# EAGLE design masterclock (EAGLE 8.1.0)
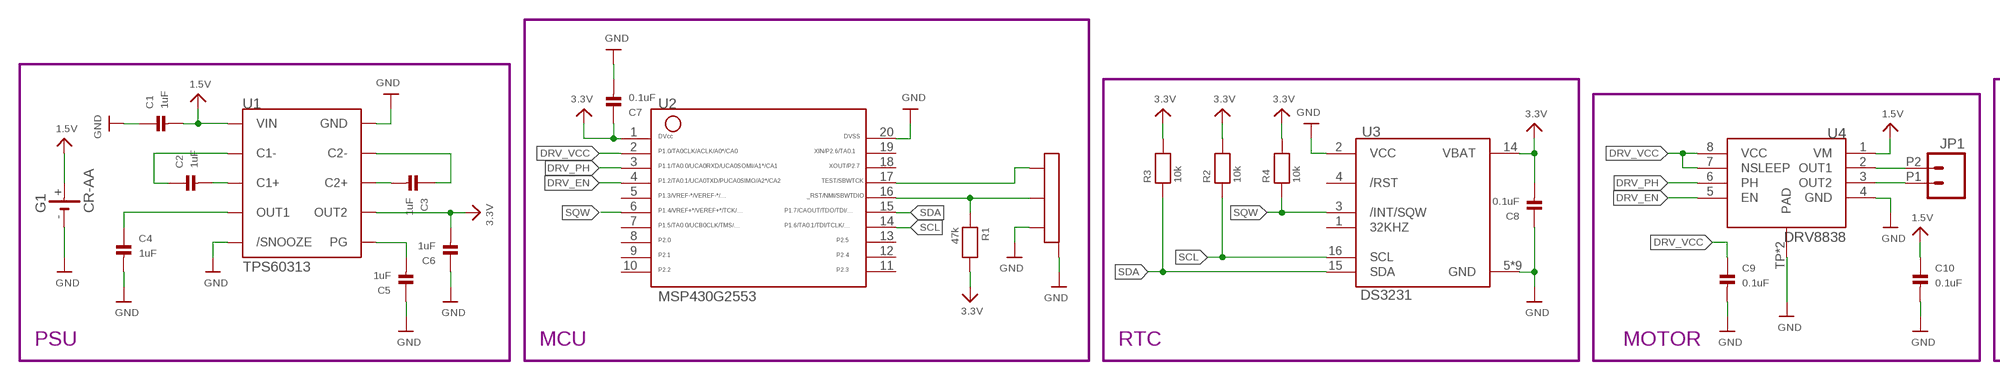
[diagram p0: schematic, sheet 1, part 1 of 2]
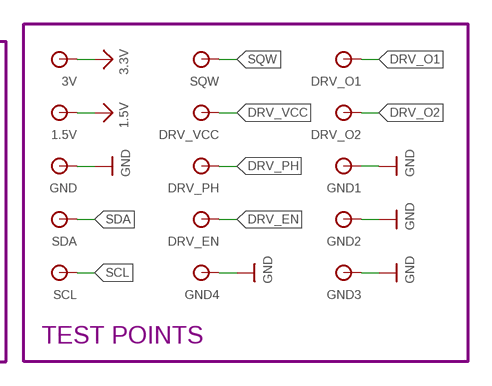
[diagram p1: schematic, sheet 1, part 2 of 2]

## Parts
1.5V  TESTPAD  [TESTPAD]
3V  TESTPAD  [TESTPAD]
C1  1uF  CAP_CERAMIC0402  [0402]
C2  1uF  CAP_CERAMIC0402  [0402]
C3  1uF  CAP_CERAMIC0402  [0402]
C4  1uF  CAP_CERAMIC0402  [0402]
C5  1uF  CAP_CERAMIC0402  [0402]
C6  1uF  CAP_CERAMIC0402  [0402]
C7  0.1uF  CAP_CERAMIC0402  [0402]
C8  0.1uF  CAP_CERAMIC0402  [0402]
C9  0.1uF  CAP_CERAMIC0402  [0402]
C10  0.1uF  CAP_CERAMIC0402  [0402]
DRV_EN  TESTPAD  [TESTPAD]
DRV_O1  TESTPAD  [TESTPAD]
DRV_O2  TESTPAD  [TESTPAD]
DRV_PH  TESTPAD  [TESTPAD]
DRV_VCC  TESTPAD  [TESTPAD]
G1  CR-AA  [CRAA]
GND  TESTPAD  [TESTPAD]
GND1  GND  TESTPAD  [TESTPAD]
GND2  GND  TESTPAD  [TESTPAD]
GND3  GND  TESTPAD  [TESTPAD]
GND4  GND  TESTPAD  [TESTPAD]
JP1  M022.54MM_SCREWTERM  [1X02_2.54_SCREWTERM]
R1  47k  RESISTOR0402  [0402]
R2  10k  RESISTOR0402  [0402]
R3  10k  RESISTOR0402  [0402]
R4  10k  RESISTOR0402  [0402]
SCL  TESTPAD  [TESTPAD]
SDA  TESTPAD  [TESTPAD]
SQW  TESTPAD  [TESTPAD]
U1  TPS60313  [MSOP10]
U2  MSP430G2553  [PW20]
U3  DS3231  [SO16]
U4  DRV8838  [WSON8]
U$27  M03  [TE-MICRO-MNL-]

## Nets
1.5V: 1.5V.P$1 C1.2 C10.1 G1.+ U1.P$3(VIN) U4.1(VM)
3.3V: 3V.P$1 C6.2 C7.1 C8.2 R1.2 R2.2 R3.2 R4.2 U1.P$6(OUT2) U2.1 U3.14(VBAT)
/RST: R1.1 U2.16 U$27.P$2
DRV_EN: DRV_EN.P$1 U2.4 U4.5(EN)
DRV_O1: DRV_O1.P$1 JP1.P2 U4.2(OUT1)
DRV_O2: DRV_O2.P$1 JP1.P1 U4.3(OUT2)
DRV_PH: DRV_PH.P$1 U2.3 U4.6(PH)
DRV_VCC: C9.1 DRV_VCC.P$1 U2.2 U4.7(NSLEEP) U4.8(VCC)
GND: C1.1 C4.2 C5.1 C6.1 C7.2 C8.1 C9.2 C10.2 G1.- GND1.P$1 GND2.P$1 GND3.P$1 GND4.P$1 GND.P$1 U1.P$1(/SNOOZE) U1.P$9(GND) U2.20 U3.2(VCC) U3.5(GND) U3.6(GND) U3.7(GND) U3.8(GND) U3.9(GND) U3.10(GND) U3.11(GND) U3.12(GND) U3.13(GND) U4.4(GND) U4.TP1(PAD) U4.TP(PAD) U$27.H1 U$27.H2 U$27.P$3
N$2: C2.2 U1.P$4(C1+)
N$3: C2.1 U1.P$2(C1-)
N$6: C3.1 U1.P$8(C2-)
N$7: C3.2 U1.P$7(C2+)
N$11: C5.2 U1.P$10(PG)
PWROUT: C4.1 U1.P$5(OUT1)
SCL: R2.1 SCL.P$1 U2.14 U3.16(SCL)
SDA: R3.1 SDA.P$1 U2.15 U3.15(SDA)
SQW: R4.1 SQW.P$1 U2.6 U3.3(/INT/SQW)
TEST: U2.17 U$27.P$1
Unconnected: U2.5 U2.7 U2.8 U2.9 U2.10 U2.11 U2.12 U2.13 U2.18 U2.19 U3.1(32KHZ) U3.4(/RST)

## Notes on the sheet
- PSU | MCU | RTC | MOTOR | TEST POINTS

## Library data of the parts
1.5V 3V DRV_EN DRV_O1 DRV_O2 DRV_PH DRV_VCC GND GND1-GND4 SCL SDA SQW = lepaute:TESTPAD
C1-C10 = lepaute:CAP_CERAMIC: Ceramic Capacitors 0402 - 0402 Surface Mount Capacitors 16pF 50V 5% [Digikey: 445-4899-2-ND] 18pF 50V 5% [Digikey: 490-1281-2-ND] 22pF 50V 5% [Digikey: 490-1283-2-ND] 68pF 50V 5% [Digikey: 490-1289-2-ND] 0.1uF 10V 10% [Digikey: 490-1318-2-ND] 1.0uF 6.3V 10% [Digikey: 490-1320-2-ND] 0603 - 0603 Surface Mount Capacitors 16 pF 50V 5% [Digikey: 445-5051-2-ND] 22 pF 50V [Digikey: PCC220ACVTR-ND] 33 pF 50V 5% [Digikey: 490-1415-1-ND] 56pF 50V 5% [Digikey: 490-1421-1-ND] 220pF 50V 5% [Digikey: 445-1285-1-ND] 680 pF 50V 2200 pF 50V 5% C0G [Digikey: 445-1297-1-ND] 5600 pF 100V 5% X7R [Digikey: 478-3711-1-ND] 0.1 µF 25V 10% [Digikey: PCC2277TR-ND] 0.22 µF 16V 10% X7R [Digikey: 445-1318-1-ND] 1.0 µF 25V 10% [Digikey: 445-5146-2-ND] 0603 - RF Specific 3pF 250V +/-0.1pF RF [Digikey: 712-1347-1-ND] 18 pF 250V 5% [Digikey: 478-3505-1-ND or 712-1322-1-ND] 56 pF 250V 5% C0G RF [Digikey: 490-4867-1-ND] 68 pF 250V RF [Digikey: 490-4868-1-ND] 0805 - 0805 Surface Mount Capacitors 220 pF 250V 2% RF Ceramic Capacitor [Digikey: 712-1398-1-ND] 1000 pF 50V 2% NP0 Ceramic Capacitor [Digikey: 478-3760-1-ND] 0.1 µF 25V 10% Ceramic Capacitor [Digikey: PCC1828TR-ND] 1.0 µF 16V 10% Ceramic Capacitor[Digikey: 490-1691-2-ND] 10.0 µF 10V 10% Ceramic Capacitor[Digikey: 709-1228-1-ND] 10.0 uF 16V 10% Ceramic Capacitor [Digikey: 478-5165-2-ND] 47 uF 6.3V 20% Ceramic Capacitor [Digikey: 587-1779-1-ND or 399-5506-1-ND] 1206 - 1206 Surface Mount Capacitors 47uF 10V 20% Ceramic Capacitor [Digikey: 490-5528-1-ND or 399-5508-1-ND or 445-6010-1-ND] 100uF 6.3V -20%, +80% Y5V Ceramic Capacitor (Digikey: 490-4512-1-ND, Mouser: 81-GRM31CF50J107ZE1L)
G1 = lepaute:CR-AA: LI BATTERY Varta CRAA-SLF
JP1 = lepaute:M02: Standard 2-pin 0.1" header. Use with - straight break away headers ( PRT-00116) - right angle break away headers (PRT-00553) - swiss pins (PRT-00743) - machine pins (PRT-00117) - female headers (PRT-00115) Molex polarized connector foot print use with: PRT-08233 with associated crimp pins and housings. 2.54_SCREWTERM for use with PRT-10571. 3.5mm Screw Terminal footprints for PRT-08084 5mm Screw Terminal footprints for use with PRT-08433
R1-R4 = lepaute:RESISTOR: Resistors 0402 - 0402 Surface Mount Package 22 Ohm 1% 1/16W [Digikey: 311-22.0LRTR-ND] 33 Ohm 5% 1/16W 1.0K 5% 1/16W 1.5K 5% 1/16W 2.0K 1% 1/16W 10.0K 1% 1/16W [Digikey: 311-10.0KLRTR-ND] 10.0K 5% 1/16W [Digikey: RMCF0402JT10K0TR-ND] 12.1K 1% 1/16W [Digikey: 311-22.0LRTR-ND] 100.0K 5% 1/16W 0603 - 0603 Surface Mount Package 0 Ohm 1/10 Watt 1% Resistor 15 Ohm 1/10 Watt 1% Resistor 33 Ohm 1/10 Watt 1% Resistor 49.9 Ohm 1/10 Watt 1% Resistor 100 Ohm 1/10 Watt 1% Resistor 150 Ohm 1/10 Watt 1% Resistor 240 Ohm 1/10 Watt 1% Resistor 390 Ohm 1/10 Watt 1% Resistor 560 Ohm 1/10 Watt 1% Resistor 680 Ohm 1/10 Watt 1% Resistor 750 Ohm 1/10 Watt 1% Resistor 1.0K Ohm 1/10 Watt 1% Resistor 1.5K Ohm 1/10 Watt 1% Resistor 2.0K Ohm 1/10 Watt 1% Resistor 2.2K Ohm 1/10 Watt 1% Resistor 3.3K Ohm 1/10 Watt 1% Resistor 4.7K Ohm 1/10 Watt 1% Resistor 10.0K Ohm 1/10 Watt 1% Resistor 12.0K Ohm 1/10 Watt 1% Resistor 12.1K Ohm 1/10 Watt 1% Resistor 20.0K Ohm 1/10 Watt 1% Resistor 33.0K Ohm 1/10 Watt 1% Resistor 100.0K Ohm 1/10 Watt 1% Resistor 0805 - 0805 Surface Mount Package 0 Ohm 1/8 Watt 1% Resistor 33 Ohm 1/8 Watt 1% Resistor 100 Ohm 1/8 Watt 1% Resistor 150 Ohm 1/8 Watt 1% Resistor 200 Ohm 1/8 Watt 1% Resistor 240 Ohm 1/8 Watt 1% Resistor 330 Ohm 1/8 Watt 1% Resistor 390 Ohm 1/8 Watt 1% Resistor 470 Ohm 1/8 Watt 1% Resistor 1.0K Ohm 1/8 Watt 1% Resistor 1.5K Ohm 1/8 Watt 1% Resistor 2.0K Ohm 1/8 Watt 1% Resistor 4.7K Ohm 1/8 Watt 1% Resistor 5.1K Ohm 1/8 Watt 1% Resistor 5.6K Ohm 1/8 Watt 1% Resistor 10.0K Ohm 1/8 Watt 1% Resistor 22.0K Ohm 1/8 Watt 1% Resistor 33.0K Ohm 1/8 Watt 1% Resistor 100K Ohm 1/8 Watt 1% Resistor 1206 - 1206 Surface Mount Package 2012 - 2010 Surface Mount Package 0.11 Ohm 1/2 Watt 1% Resistor - Digikey: RHM.11UCT-ND
U1 = lepaute:TPS60313
U2 = lepaute:MSP430G2553: MSP430G2XX1 TSSOP (PW) 20 Pin Package
U3 = lepaute:DS3231: SPI RTC module with battery backup and internal clock.
U4 = lepaute:DRV8838
U$27 = lepaute:M03

## Board
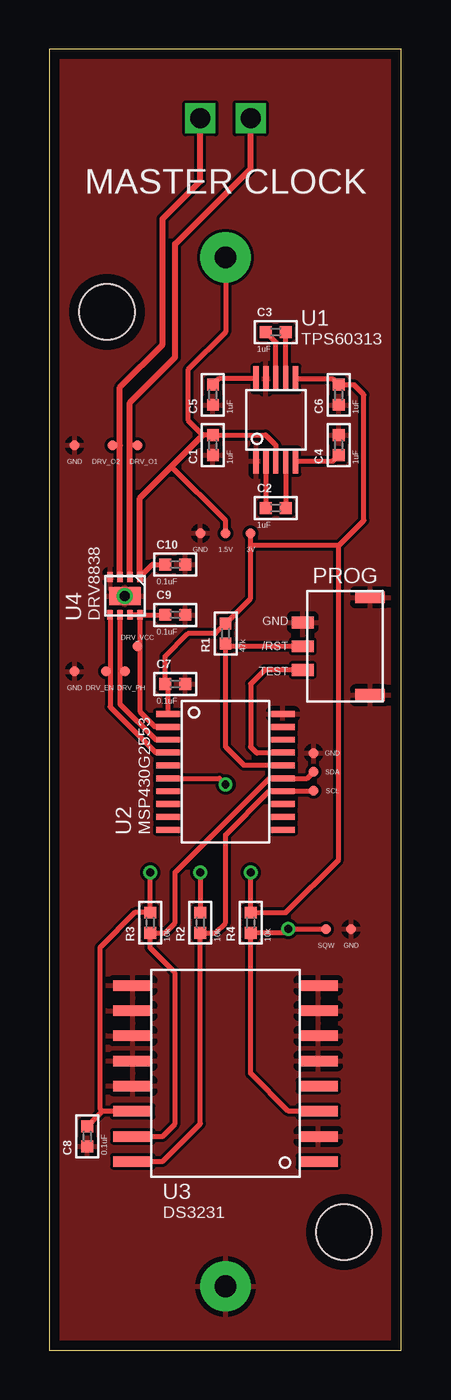
[diagram p2: board, top side]
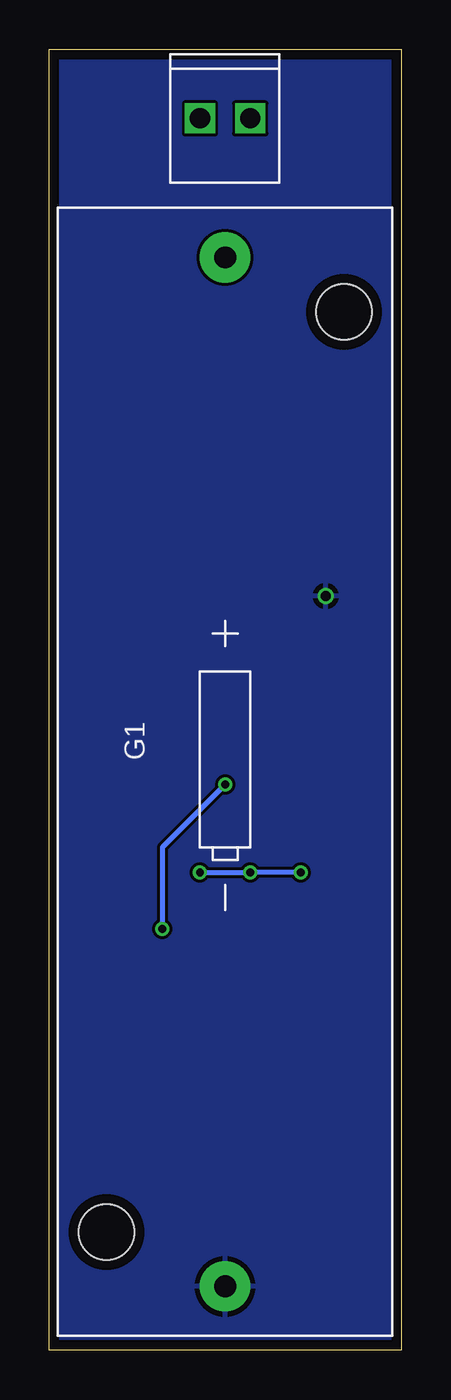
[diagram p3: board, bottom side, seen from below]

Size 17.76 x 65.71 mm. Coordinates in mm from the lower left corner, seen from the top.
Outline: 0,0 17.76,0 17.76,65.71 0,65.71 0,0
Copper layers (1*16): Top 0.035mm / dielectric 1.6mm / Bottom 0.035mm
Design rules "Elecrow_2-layer_PCB_eagle_rule": minimum track width 6mil, minimum drill 12mil, track to track 6mil, track to pad 6mil, pad to pad 6mil, via to via 8mil, smd to smd 0mil, copper to edge 20mil, drill to drill 10mil, minimum pad ring 6mil, minimum via ring 6mil, stop-mask expansion 0mil, vias tented up to drill 100mil, thermal gap 10mil

### Footprints (pad centres in the part's own frame; a part is rotated, then mirrored left to right if it is on the bottom)
TESTPAD = smd 0.5 x 0.5: P$1 0,0
0402 = smd 0.6 x 0.6: 1 -0.508,0; 2 0.508,0
CRAA = drill 1.1 pad 2.54: + -25.995,0; - 25.995,0 | hole 2.8: -23.24,5.995; 23.24,-5.995
1X02_2.54_SCREWTERM = drill 1.016 square: P1 2.54,0; P2 0,0
MSOP10 = smd 1.27 x 0.27: P$1 -2.083,1; P$2 -2.083,0.5; P$3 -2.083,0; P$4 -2.083,-0.5; P$5 -2.083,-1; P$6 2.083,-1; P$7 2.083,-0.5; P$8 2.083,0; P$9 2.083,0.5; P$10 2.083,1
PW20 = smd 0.3 x 1.2: 1 -2.925,-2.9; 2 -2.275,-2.9; 3 -1.625,-2.9; 4 -0.975,-2.9; 5 -0.325,-2.9; 6 0.325,-2.9; 7 0.975,-2.9; 8 1.625,-2.9; 9 2.275,-2.9; 10 2.925,-2.9; 11 2.925,2.9; 12 2.275,2.9; 13 1.625,2.9; 14 0.975,2.9; 15 0.325,2.9; 16 -0.325,2.9; 17 -0.975,2.9; 18 -1.625,2.9; 19 -2.275,2.9; 20 -2.925,2.9
SO16 = smd 0.53 x 1.98: 1 -4.445,-4.685; 2 -3.175,-4.685; 3 -1.905,-4.685; 4 -0.635,-4.685; 5 0.635,-4.685; 6 1.905,-4.685; 7 3.175,-4.685; 8 4.445,-4.685; 9 4.445,4.685; 10 3.175,4.685; 11 1.905,4.685; 12 0.635,4.685; 13 -0.635,4.685; 14 -1.905,4.685; 15 -3.175,4.685; 16 -4.445,4.685
WSON8 = smd 0.5 x 0.28: 1 -0.95,0.75; 2 -0.95,0.25; 3 -0.95,-0.25; 4 -0.95,-0.75; 5 0.95,-0.75; 6 0.95,-0.25; 7 0.95,0.25; 8 0.95,0.75 | smd 0.9 x 1.6: TP 0,0 | drill 0.5: TP1 0,0
TE-MICRO-MNL- = smd 0.6 x 1.5: H1 -2.47,0; H2 2.47,0 | smd 0.6 x 1.1: P$1 -1.2,3.4; P$2 0,3.4; P$3 1.2,3.4

### Placement (x,y rotation side)
1.5V  8.89,41.27 0 top
3V  10.16,41.27 0 top
C1  8.26,45.72 90 top
C2  11.43,42.55 0 top
C3  11.43,51.44 0 top
C4  14.61,45.72 90 top
C5  8.26,48.26 90 top
C6  14.61,48.26 90 top
C7  6.35,33.66 0 top
C8  1.91,10.79 90 top
C9  6.35,37.15 0 top
C10  6.35,39.69 0 top
DRV_EN  2.86,34.29 0 top
DRV_O1  4.45,45.72 0 top
DRV_O2  3.17,45.72 0 top
DRV_PH  3.81,34.29 0 top
DRV_VCC  4.45,35.56 0 top
G1  8.89,29.21 270 bottom
GND  7.62,41.27 0 top
GND1  1.27,34.29 0 top
GND2  13.34,30.16 0 top
GND3  1.27,45.72 0 top
GND4  15.24,21.27 0 top
JP1  10.16,62.23 0 bottom
R1  8.89,36.2 90 top
R2  7.62,21.59 90 top
R3  5.08,21.59 90 top
R4  10.16,21.59 90 top
SCL  13.34,28.26 0 top
SDA  13.34,29.21 0 top
SQW  13.97,21.27 0 top
U1  11.43,46.99 90 top
U2  8.89,29.21 270 top
U3  8.89,13.97 90 top
U4  3.81,38.1 270 top
U$27  16.19,35.56 90 top

### Tracks (layer width: path | path; a pad name or v marks a point on that pad's centre or on a via)
1.5V
  Top 0.254: U1.P$3 11.43,45.72 10.92,46.23 C1.2 7.75,46.23 6.99,46.99 6.99,49.53 8.89,51.44 G1.+ | 1.5V.P$1 8.89,41.91 6.16,44.64 | U4.1 5.2,39.69 C10.1
  Top 0.305: U4.1 4.56,43.04 6.16,44.64 7.75,46.23
3.3V  (via drill 0.4)
  Top 0.254: U1.P$6 14.3,49.07 C6.2 15.37,48.77 15.88,48.26 15.88,41.91 14.61,40.64 | U3.14 2.67,12.06 | 2.67,12.06 C8.2 | U2.1 5.99,33.51 C7.1 5.84,35.05 6.99,36.2 8.38,36.2 R1.2 10.16,37.97 10.16,40.64 | 2.67,12.06 2.54,12.19 2.54,20.32 4.32,22.1 R3.2 v5.08,24.13 | v10.16,24.13 R4.2 11.94,22.1 14.61,24.77 14.61,40.64 | v7.62,24.13 R2.2 | 10.16,40.64 3V.P$1 | 14.61,40.64 10.16,40.64
  Bottom 0.254: v10.16,24.13 v7.62,24.13 v5.08,24.13
/RST
  Top 0.254: U2.16 9.84,29.54 8.89,30.48 R1.1 9.02,35.56 U$27.P$2
DRV_EN
  Top 0.254: U2.4 5.38,30.18 3.06,32.5 3.06,34.29 | U4.5 3.06,34.29 | DRV_EN.P$1 3.06,34.29
DRV_O1
  Top 0.254: DRV_O1.P$1 4.06,45.72
  Top 0.305: U4.2 4.06,45.72 4.06,47.88 6.35,50.16 6.35,55.88 10.16,59.69 JP1.P2
DRV_O2
  Top 0.254: DRV_O2.P$1 3.56,45.72
  Top 0.305: U4.3 3.56,45.72 3.56,48.65 5.71,50.8 5.71,57.15 7.62,59.05 JP1.P1
DRV_PH
  Top 0.254: U2.3 5.36,30.84 3.56,32.63 3.56,34.29 | U4.6 3.56,34.29 | DRV_PH.P$1 3.56,34.29
DRV_VCC
  Top 0.254: U2.2 5.34,31.48 4.56,32.27 4.56,35.56 | U4.8 4.56,35.56 | DRV_VCC.P$1 4.56,35.56 | U4.8 C9.1 | U4.7 U4.8
GND
  pour Top: -1.27,67.31 19.05,67.31 19.05,-1.27 -1.27,-1.27
  pour Bottom: -1.27,-1.27 19.05,-1.27 19.05,67.31 -1.27,67.31
N$2
  Top 0.254: U1.P$4 C2.2
N$3
  Top 0.254: U1.P$2 C2.1
N$6
  Top 0.254: U1.P$8 11.43,50.93 C3.1
N$7
  Top 0.254: U1.P$7 11.93,51.43 C3.2
N$11
  Top 0.254: U1.P$10 8.56,49.07 C5.2
PWROUT
  Top 0.254: U1.P$5 14.3,44.91 C4.1
SCL
  Top 0.254: U3.16 5.71,9.53 7.62,11.43 R2.1 8.38,21.08 8.89,21.59 8.89,26.04 11.09,28.23 U2.14 13.31,28.23 SCL.P$1
SDA
  Top 0.254: U3.15 5.71,10.79 6.35,11.43 6.35,19.05 5.08,20.32 R3.1 5.84,21.08 6.35,21.59 6.35,24.13 11.11,28.89 U2.15 13.01,28.89 SDA.P$1
SQW  (via drill 0.4)
  Top 0.254: U3.3 12.06,12.06 10.16,13.97 R4.1 11.87,21.08 v12.06,21.27 SQW.P$1 | U2.6 8.58,28.89 v8.89,28.57
  Bottom 0.254: v8.89,28.57 12.06,25.4 v12.06,21.27
TEST
  Top 0.254: U2.17 11.77,30.16 10.48,30.16 10.16,30.48 10.16,33.66 10.87,34.36 U$27.P$1

### Text on the board
tPlace: GND | PROG | GND | /RST | TEST | GND | GND | GND
tNames: MASTER CLOCK